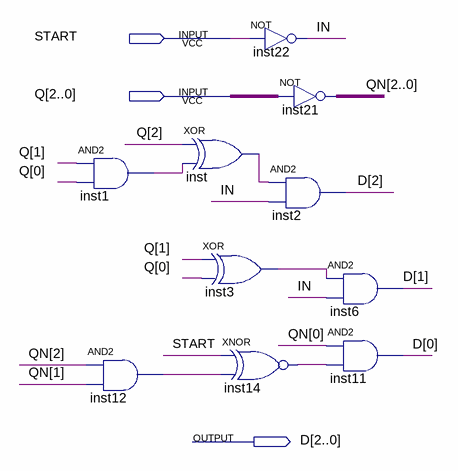
[diagram p0: schematic sheet]
// Quartus schematic NEXTSTATE.bdf as structural Verilog: 10 symbols, 3 pins
module NEXTSTATE (
  input  START,
  input  [2:0] Q,
  output [2:0] D
);

  wire IN, inst1_out, inst3_out, inst12_out, inst14_out, inst_out;
  wire [2:0] QN;

  and inst1 (inst1_out, Q[1], Q[0]);
  and inst12 (inst12_out, QN[2], QN[1]);
  xor inst (inst_out, Q[2], inst1_out);
  xor inst3 (inst3_out, Q[1], Q[0]);
  xnor inst14 (inst14_out, START, inst12_out);
  not inst22 (IN, START);
  assign QN = ~Q;  // NOT inst21, 3 bits wide
  and inst2 (D[2], inst_out, IN);
  and inst6 (D[1], inst3_out, IN);
  and inst11 (D[0], QN[0], inst14_out);
endmodule
